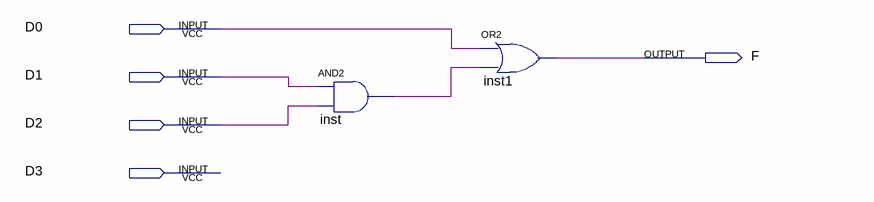
[diagram p0: schematic sheet]
// Quartus schematic No2.bdf as structural Verilog: 2 symbols, 5 pins
module No2 (
  input  D0,
  input  D1,
  input  D2,
  input  D3,
  output F
);

  wire inst_out;

  and inst (inst_out, D1, D2);
  or inst1 (F, D0, inst_out);
endmodule
